# Altium schematic sheet Connector_Sheet2.SchDoc
size 420 x 297 mm; SheetNumber: 8; SheetTotal: 8
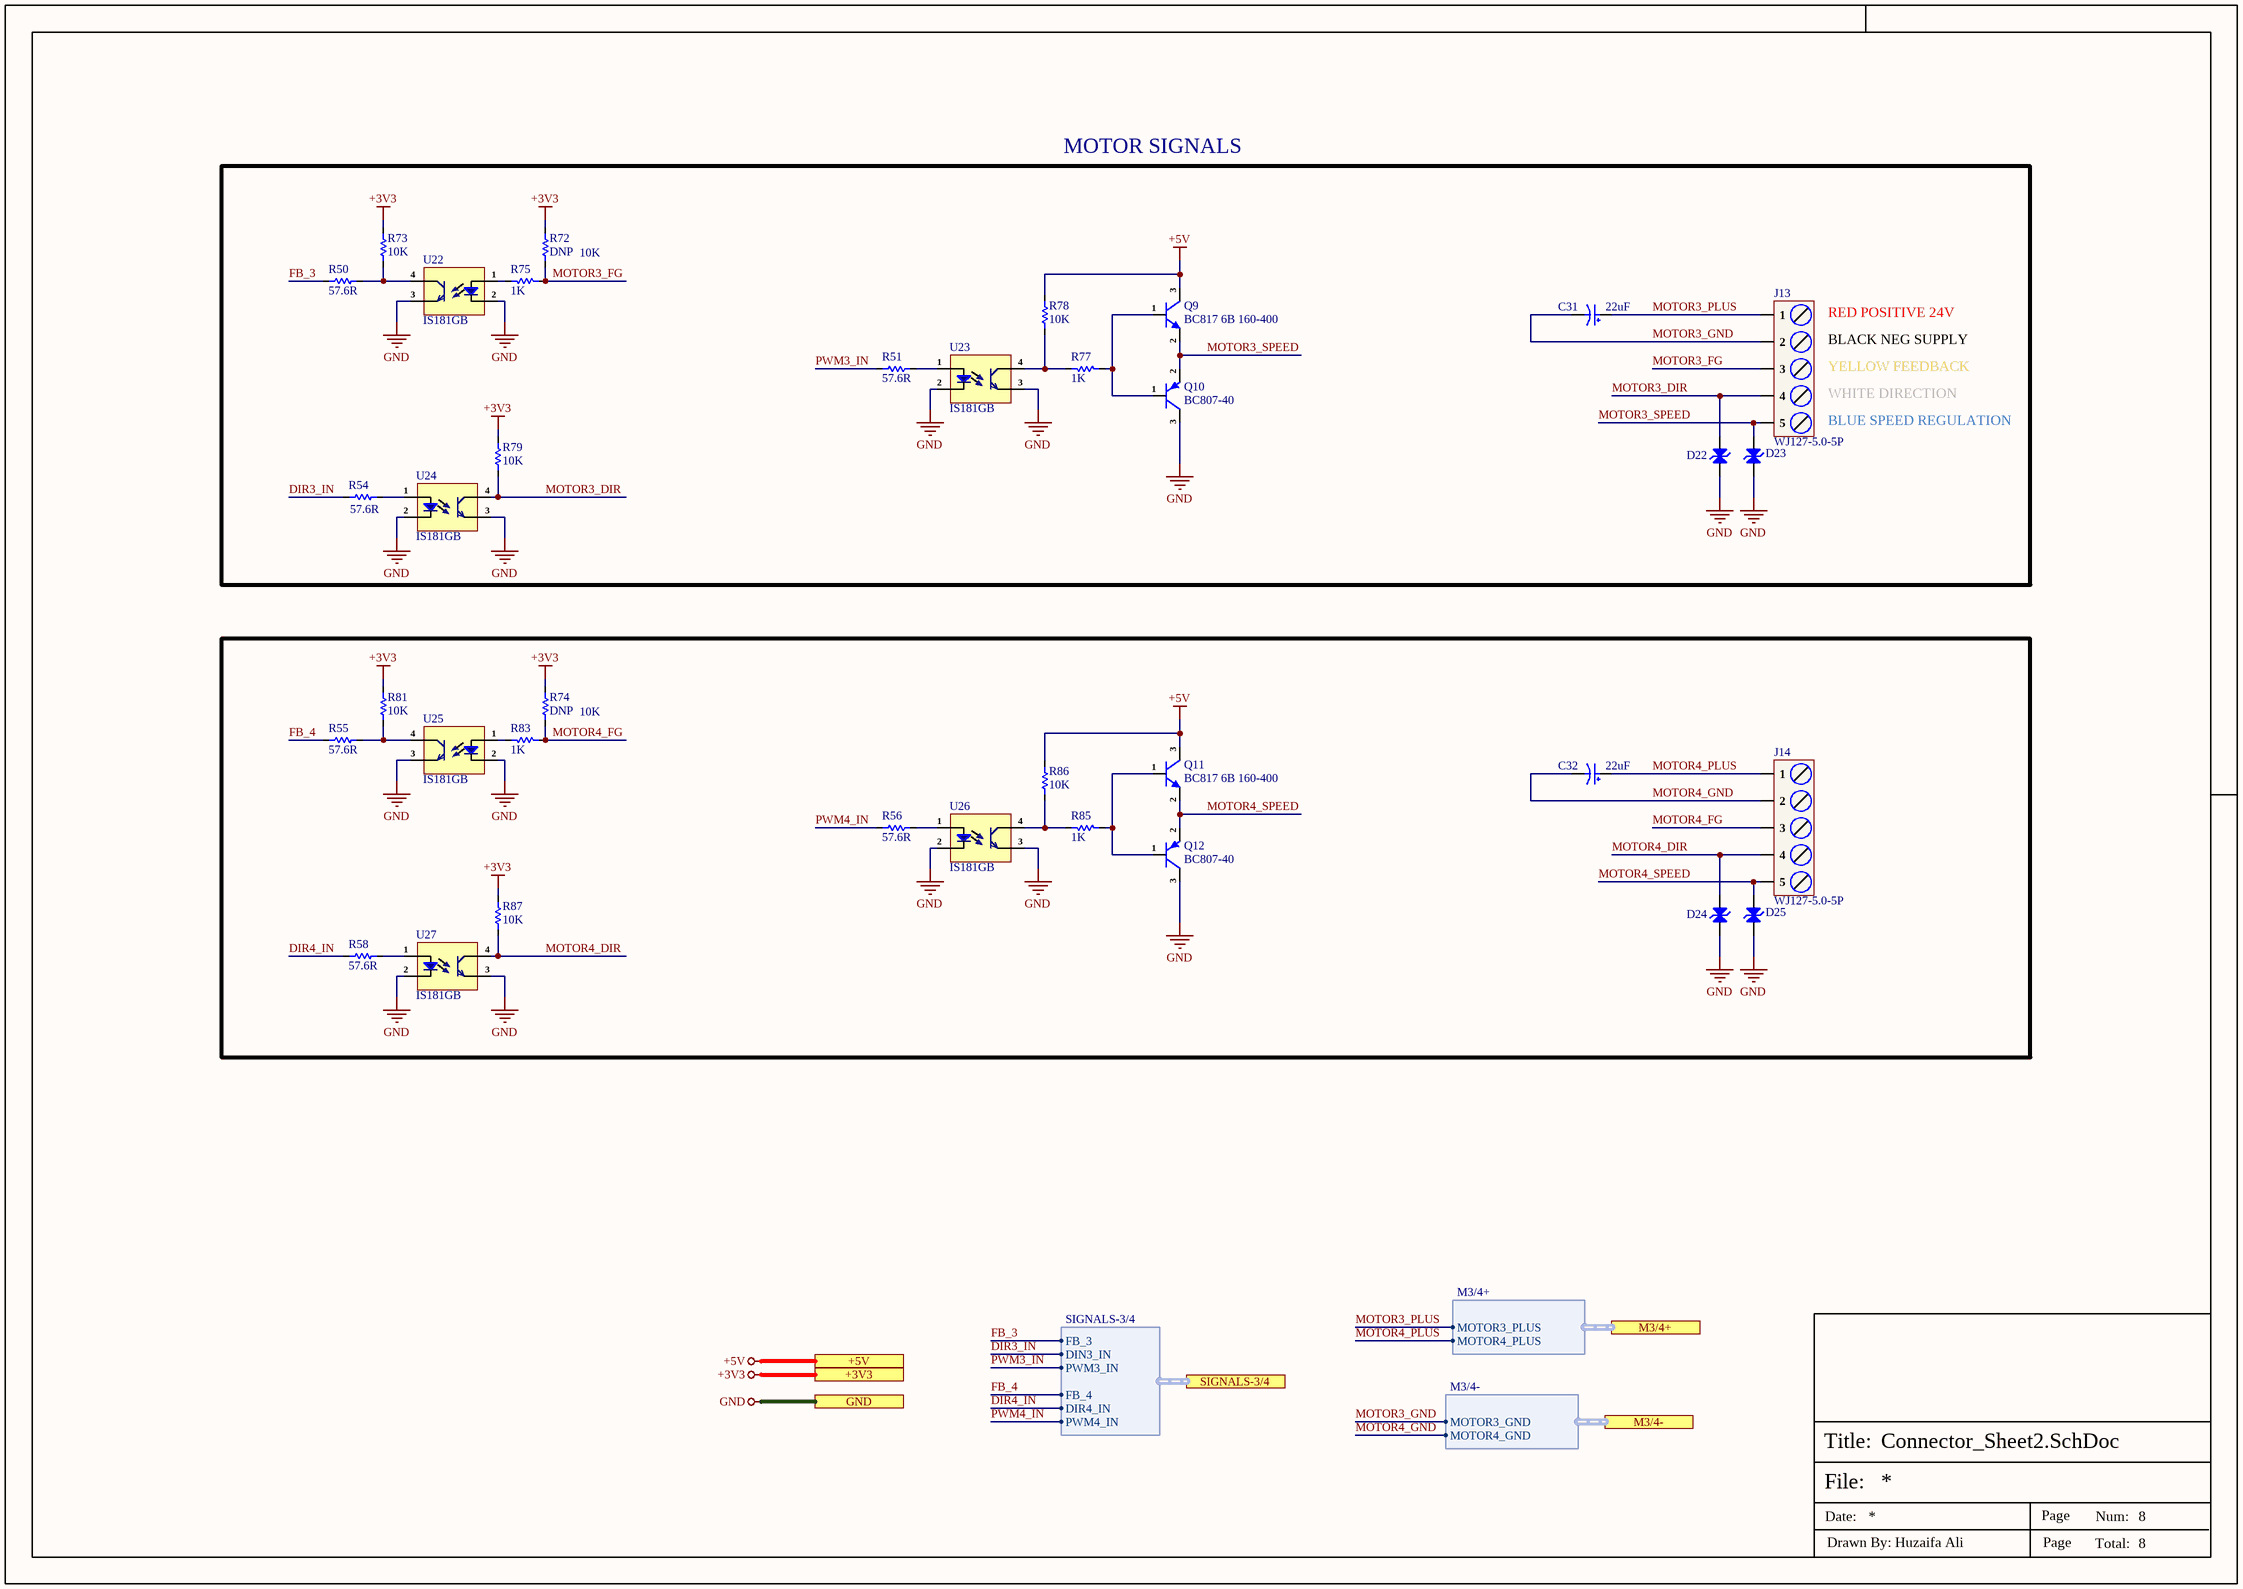
[diagram p0: Connector_Sheet2.SchDoc]

## Parts
C31  22uF  [VKMD1652D220MV]
C32  22uF  [VKMD1652D220MV]
D22  ESD5B5.0ST1G  [SOD-523]  (value not drawn)
D23  ESD5B5.0ST1G  [SOD-523]  (value not drawn)
D24  ESD5B5.0ST1G  [SOD-523]  (value not drawn)
D25  ESD5B5.0ST1G  [SOD-523]  (value not drawn)
J13  WJ127-5.0-5P  [WJ127-5.0-5P]
J14  WJ127-5.0-5P  [WJ127-5.0-5P]
Q9  BC817 6B 160-400  [SOT-23]
Q10  BC807-40  [SOT-23]
Q11  BC817 6B 160-400  [SOT-23]
Q12  BC807-40  [SOT-23]
R50  57.6R  [Res-0402]
R51  57.6R  [Res-0402]
R54  57.6R  [Res-0402]
R55  57.6R  [Res-0402]
R56  57.6R  [Res-0402]
R58  57.6R  [Res-0402]
R72  DNP  [Res-0402]
R73  10K  [Res-0402]
R74  DNP  [Res-0402]
R75  1K  [Res-0402]
R77  1K  [Res-0402]
R78  10K  [Res-0402]
R79  10K  [Res-0402]
R81  10K  [Res-0402]
R83  1K  [Res-0402]
R85  1K  [Res-0402]
R86  10K  [Res-0402]
R87  10K  [Res-0402]
U22  IS181GB  [SOP-4_2.54]
U23  IS181GB  [SOP-4_2.54]
U24  IS181GB  [SOP-4_2.54]
U25  IS181GB  [SOP-4_2.54]
U26  IS181GB  [SOP-4_2.54]
U27  IS181GB  [SOP-4_2.54]

## Blocks framed on the sheet
10K: C32 D24 D25 J14 Q11 Q12 R55 R56 R58 R74 R81 R83 R85-R87 U25-U27

## Ports
+3V3 (see Top_Sheet[3C], CAN_Sheet[5D], Connector_Sheet1[5D], Controller_Sheet[2D], Motor_Driver_Sheet[5D], Power_Sheet[5D], RS485_RS232_Sheet[5D]), +5V (see Top_Sheet[3C], CAN_Sheet[5D], Connector_Sheet1[5D], Power_Sheet[5D]), GND (see Top_Sheet[3C], CAN_Sheet[5D], Connector_Sheet1[5D], Controller_Sheet[2D], Motor_Driver_Sheet[5D], Power_Sheet[5D], RS485_RS232_Sheet[5D]), M3/4+ (harness M3/4+, see Top_Sheet[3C], Motor_Driver_Sheet[3D]), M3/4- (harness M3/4-, see Top_Sheet[3C], Motor_Driver_Sheet[2D]), SIGNALS-3/4 (harness SIGNALS-3/4, see Top_Sheet[4C], Controller_Sheet[1D])

## Harnesses
M3/4+: MOTOR3_PLUS, MOTOR4_PLUS
M3/4-: MOTOR3_GND, MOTOR4_GND
SIGNALS-3/4: FB_3, DIN3_IN, PWM3_IN, FB_4, DIR4_IN, PWM4_IN

## Nets
+3V3: R72.2 R73.2 R74.2 R79.2 R81.2 R87.2 ; port +3V3
+5V: Q9.3(C) Q11.3(C) R78.1 R86.1 ; port +5V
GND: D22.1(A) D23.1(A) D24.1(A) D25.1(A) Q10.3(C) Q12.3(C) U22.2(Ca) U22.3(E) U23.2(Ca) U23.3(E) U24.2(Ca) U24.3(E) U25.2(Ca) U25.3(E) U26.2(Ca) U26.3(E) U27.2(Ca) U27.3(E) ; port GND
DIR3_IN: R54.1 ; port SIGNALS-3/4.DIN3_IN
DIR4_IN: R58.1 ; port SIGNALS-3/4.DIR4_IN
FB_3: R50.1 ; port SIGNALS-3/4.FB_3
FB_4: R55.1 ; port SIGNALS-3/4.FB_4
MOTOR3_DIR: D22.2(A) J13.4 R79.1 U24.4(C)
MOTOR3_FG: J13.3 R72.1 R75.1
MOTOR3_GND: C31.2 J13.2 ; port M3/4-.MOTOR3_GND
MOTOR3_PLUS: C31.1 J13.1 ; port M3/4+.MOTOR3_PLUS
MOTOR3_SPEED: D23.2(A) J13.5 Q9.2(E) Q10.2(E)
MOTOR4_DIR: D24.2(A) J14.4 R87.1 U27.4(C)
MOTOR4_FG: J14.3 R74.1 R83.1
MOTOR4_GND: C32.2 J14.2 ; port M3/4-.MOTOR4_GND
MOTOR4_PLUS: C32.1 J14.1 ; port M3/4+.MOTOR4_PLUS
MOTOR4_SPEED: D25.2(A) J14.5 Q11.2(E) Q12.2(E)
PWM3_IN: R51.1 ; port SIGNALS-3/4.PWM3_IN
PWM4_IN: R56.1 ; port SIGNALS-3/4.PWM4_IN
NetQ9_1: Q9.1(B) Q10.1(B) R77.1
NetQ11_1: Q11.1(B) Q12.1(B) R85.1
NetR50_2: R50.2 R73.1 U22.4(C)
NetR51_2: R51.2 U23.1(An)
NetR54_2: R54.2 U24.1(An)
NetR55_2: R55.2 R81.1 U25.4(C)
NetR56_2: R56.2 U26.1(An)
NetR58_2: R58.2 U27.1(An)
NetR75_2: R75.2 U22.1(An)
NetR77_2: R77.2 R78.2 U23.4(C)
NetR83_2: R83.2 U25.1(An)
NetR85_2: R85.2 R86.2 U26.4(C)

## Notes on the sheet
- MOTOR SIGNALS
- 10K
- RED POSITIVE 24V
- BLACK NEG SUPPLY
- YELLOW FEEDBACK
- WHITE DIRECTION
- BLUE SPEED REGULATION
- File:
- Title:
- Date:
- Page
- Num:
- Total:
- Drawn By: Huzaifa Ali

## Library data of the parts
C31 C32 = VKMD1652D220MV: 22uF 200V 320mA@100kHz ±20% SMD,D8xL16.5mm Aluminum Electrolytic Capacitors - SMD ROHS; Manufacturer: Ymin; Manufacturer Part Number: VKMD1652D220MV; Package: SMD,D8xL16.5mm; LCSC Part Number: C487500; Item Type: Electrolytic Capacitor; ComponentLink1Description: LCSC; ComponentLink1URL: https://www.lcsc.com/product-detail/Aluminum-Electrolytic-Capacitors-SMD_Ymin-VKMD1652D220MV_C487500.html
D22-D25 = ESD5B5.0ST1G: TVS DIODE 5VWM SOD523; Manufacturer: ON Semiconductor; Item Type: ESD Protection Device; Supplier: Future Electronics; Supplier Part Number: 1159725; Manufacturer Part Number: ESD5B5.0ST1G; RoHS: Yes; Category: ESD and Circuit Protection ICs; Stock: 486000; Pricing: 3000=0.0396, 9000=0.0381, 15000=0.0375, 60000=0.0357, 90000=0.0346 (USD); ComponentLink1URL: https://datasheet.ciiva.com/339/esd5b5-0st1g-339772.pdf?src-supplier=Avnet; ComponentLink1Description: https://datasheet.ciiva.com/339/esd5b5-0st1g-339772.pdf?src-supplier=Avnet; ComponentLink2URL: https://datasheet.ciiva.com/339/esd5b5-0st1g-339772.pdf?src-supplier=Digi-Key; ComponentLink2Description: https://datasheet.ciiva.com/339/esd5b5-0st1g-339772.pdf?src-supplier=Digi-Key; ComponentLink3URL: https://datasheet.ciiva.com/22637/716649-22637178.pdf?src-supplier=Element14; ComponentLink3Description: https://datasheet.ciiva.com/22637/716649-22637178.pdf?src-supplier=Element14; ComponentLink4URL: https://datasheet.ciiva.com/4510/esd5b5-0st1g-241623-4510548.pdf?src-supplier=Mouser; ComponentLink4Description: https://datasheet.ciiva.com/4510/esd5b5-0st1g-241623-4510548.pdf?src-supplier=Mouser; ComponentLink5URL: https://datasheet.ciiva.com/339/esd5b5-0st1-d-339773.pdf?src-supplier=Digi-Key; ComponentLink5Description: https://datasheet.ciiva.com/339/esd5b5-0st1-d-339773.pdf?src-supplier=Digi-Key; ComponentLink6URL: https://datasheet.ciiva.com/339/esd5b5-0st1-d-339774.pdf?src-supplier=Digi-Key; ComponentLink6Description: https://datasheet.ciiva.com/339/esd5b5-0st1-d-339774.pdf?src-supplier=Digi-Key; LCSC Part Number: C93623
J13 J14 = WJ127-5.0-5P: 1x5P -40℃~+105℃ 15A 250V Green 14~26 Straight pin 5mm 1.5 1 5 Plugin,P=5mm Screw terminal ROHS; Manufacturer: Ningbo Kangnex Elec; ComponentLink1Description: LCSC; ComponentLink1URL: https://www.lcsc.com/product-detail/Screw-terminal_Ningbo-Kangnex-Elec-WJ127-5-0-5P_C192780.html; Manufacturer Part Number: WJ127-5.0-5P; Package: Plugin,P=5mm; LCSC Part Number: C192780; Item Type: Screw terminal
Q9 Q11 = BC817 6B 160-400: 45V 300mW 100@100mA,1V 500mA NPN SOT-23 Bipolar Transistors - BJT ROHS; Manufacturer: DOWO; Manufacturer Part Number: BC817 6B 160-400; Package: SOT-23; LCSC Part Number: C371086; Item Type: Transistor; ComponentLink1Description: LCSC; ComponentLink1URL: https://www.lcsc.com/product-detail/Bipolar-Transistors-BJT_DOWO-BC817-6B-160-400_C371086.html
Q10 Q12 = BC807-40: 45V 310mW 250@100mA,1V 800mA SOT-23 Bipolar (BJT) ROHS; Manufacturer: KEXIN; Item Type: (BJT); Manufacturer Part Number: BC807-40; Package: SOT-23; LCSC Part Number: C489159; ComponentLink1Description: LCSC; ComponentLink1URL: https://www.lcsc.com/product-detail/Bipolar-BJT_KEXIN-BC807-40_C489159.html
R50 R51 R54-R56 R58 = ERJ-2RKF57R6X: RES SMD 57.6 OHM 1% 1/10W 0402; Manufacturer: Panasonic; Item Type: Resistors; Supplier: Mouser; Supplier Part Number: 667-ERJ-2RKF57R6X; Manufacturer Part Number: ERJ-2RKF57R6X; RoHS: Yes; Stock: 32931; Pricing: 1=0.1, 10=0.015, 50=0.015, 100=0.009, 1000=0.006, 10000=0.003 (USD); ComponentLink1URL: https://datasheet.ciiva.com/9188/aoa0000ce2-9188571.pdf?src-supplier=Avnet; ComponentLink1Description: https://datasheet.ciiva.com/9188/aoa0000ce2-9188571.pdf?src-supplier=Avnet; ComponentLink2URL: https://datasheet.ciiva.com/9188/aoa0000ce2-9188574.pdf?src-supplier=Avnet; ComponentLink2Description: https://datasheet.ciiva.com/9188/aoa0000ce2-9188574.pdf?src-supplier=Avnet; ComponentLink3URL: https://datasheet.ciiva.com/24026/aoa0000ce2-24026248.pdf?src-supplier=Mouser; ComponentLink3Description: https://datasheet.ciiva.com/24026/aoa0000ce2-24026248.pdf?src-supplier=Mouser; ComponentLink4URL: https://datasheet.ciiva.com/43467/1678782-43467198.pdf?src-supplier=Farnell; ComponentLink4Description: https://datasheet.ciiva.com/43467/1678782-43467198.pdf?src-supplier=Farnell; ComponentLink5URL: https://datasheet.ciiva.com/46372/1678782-46372935.pdf?src-supplier=Element14; ComponentLink5Description: https://datasheet.ciiva.com/46372/1678782-46372935.pdf?src-supplier=Element14; ComponentLink6URL: https://datasheet.ciiva.com/46372/1678782-46372936.pdf?src-supplier=Element14; ComponentLink6Description: https://datasheet.ciiva.com/46372/1678782-46372936.pdf?src-supplier=Element14; ComponentLink7URL: https://datasheet.ciiva.com/22668/1678782-22668391.pdf?src-supplier=Element14; ComponentLink7Description: https://datasheet.ciiva.com/22668/1678782-22668391.pdf?src-supplier=Element14; ComponentLink8URL: https://datasheet.ciiva.com/22743/1678782-22743894.pdf?src-supplier=Element14; ComponentLink8Description: https://datasheet.ciiva.com/22743/1678782-22743894.pdf?src-supplier=Element14; ComponentLink9URL: https://datasheet.ciiva.com/30107/aoa0000ce2-30107676.pdf?src-supplier=Onlinecomponents.com; ComponentLink9Description: https://datasheet.ciiva.com/30107/aoa0000ce2-30107676.pdf?src-supplier=Onlinecomponents.com; LCSC Part Number: C3025671
R72-R74 R78 R79 R81 R86 R87 = RC0402FR-0710KL: RES 10K OHM 1% 1/16W 0402; Manufacturer: Yageo; Resistance: 10kR; Voltage Rating (DC): 50V; Temperature Coefficient: 100ppm/°C; Power Rating: 62.5mW; Max Power Dissipation: 63mW; Item Type: Resistor; Supplier 1: Mouser; Manufacturer Part Number: RC0402FR-0710KL; RoHS: Yes; Category: Chip SMD Resistors; Stock 1: 18648329; Pricing 1: 1=0.10000, 10=0.01400, 50=0.01400, 100=0.00500, 1000=0.00300, 10000=0.00200 (USD); Case/Package: 0402; Number of Pins: 2; Case Code (Imperial): 0402; Case Code (Metric): 1005; Min Operating Temperature: -55°C; Max Operating Temperature: 155°C; Resistor Type: Thick Film; Tolerance: 1%; Packaging: Tape and Reel; Voltage Rating: 50V; Termination: SMD/SMT; Working Voltage: 50V; Number of Terminations: 2; Features: Moisture Resistant; Series: RC; Resistance Tolerance: 1%; Construction: Rectangular; Length: 1mm; Width: 0.5mm; Height: 0.32mm; Depth: 0.5mm; Lead Pitch: 0.2mm; REACH SVHC: No SVHC; Lead Free: Lead Free; RoHS Compliant: Yes; Military Standard: Not; ComponentLink1URL: https://datasheet.ciiva.com/7660/38568-7660787.pdf?src-supplier=Element14; ComponentLink1Description: https://datasheet.ciiva.com/7660/38568-7660787.pdf?src-supplier=Element14; ComponentLink2URL: https://datasheet.ciiva.com/7849/1686128-7849814.pdf?src-supplier=Element14; ComponentLink2Description: https://datasheet.ciiva.com/7849/1686128-7849814.pdf?src-supplier=Element14; ComponentLink3URL: https://datasheet.ciiva.com/7983/1018594-7983486.pdf?src-supplier=Element14; ComponentLink3Description: https://datasheet.ciiva.com/7983/1018594-7983486.pdf?src-supplier=Element14; ComponentLink4URL: https://datasheet.ciiva.com/22747/1018594-22747512.pdf?src-supplier=Element14; ComponentLink4Description: https://datasheet.ciiva.com/22747/1018594-22747512.pdf?src-supplier=Element14; ComponentLink5URL: https://datasheet.ciiva.com/12667/pyu-rc0402-51-rohs-l-6-r-12667067.pdf?src-supplier=Mouser; ComponentLink5Description: https://datasheet.ciiva.com/12667/pyu-rc0402-51-rohs-l-6-r-12667067.pdf?src-supplier=Mouser; ComponentLink6URL: https://datasheet.ciiva.com/7849/1784430-7849813.pdf?src-supplier=Element14; ComponentLink6Description: https://datasheet.ciiva.com/7849/1784430-7849813.pdf?src-supplier=Element14; ComponentLink7URL: https://datasheet.ciiva.com/7849/1784430-7849815.pdf?src-supplier=Element14; ComponentLink7Description: https://datasheet.ciiva.com/7849/1784430-7849815.pdf?src-supplier=Element14; Supplier Part Number 1: 603-RC0402FR-0710KL; LCSC Part Number: C60490
R75 R77 R83 R85 = CRCW04021K00FKEDHP: RES SMD 1K OHM 1% 1/5W 0402; Manufacturer: Vishay Dale; Resistance: 1kR; Temperature Coefficient: 100ppm/°C; Power Rating: 125mW; Voltage Rating: 50V; Supplier 1: Digi-Key; Manufacturer Part Number: CRCW04021K00FKEDHP; Stock 1: 315989; Pricing 1: 1=0.15, 10=0.132, 100=0.0506, 1000=0.02226, 2500=0.01923, 5000=0.0172 (USD); Mount: Surface Mount; Case/Package: 0402; Number of Pins: 2; Contact Plating: Tin; Weight: 2.3E-05oz; Case Code (Imperial): 0402; Case Code (Metric): 1005; Size Code: 0402; Min Operating Temperature: -55°C; Max Operating Temperature: 155°C; Tolerance: 1%; Resistor Type: Thick Film; Package Quantity: 10; Packaging: Tape and Reel; Number of Terminations: 2; Termination: SMD/SMT; Max Power Dissipation: 125mW; Voltage Rating (DC): 50V; Features: Automotive AEC-Q200; Series: CRCW-HP; Construction: Rectangular; Technology: THICK FILM; Resistance Tolerance: 1%; Length: 1mm; Width: 0.5mm; Height: 0.3mm; Depth: 0.5mm; Radiation Hardening: No; REACH SVHC: Unknown; Military Standard: Not; Lead Free: Lead Free; RoHS Compliant: Yes; ComponentLink1URL: http://www.farnell.com/datasheets/2339608.pdf?src-supplier=Element14; ComponentLink1Description: http://www.farnell.com/datasheets/2339608.pdf?src-supplier=Element14; ComponentLink2URL: http://www.vishay.com/docs/20043/crcwhpe3.pdf?src-supplier=Digi-Key; ComponentLink2Description: http://www.vishay.com/docs/20043/crcwhpe3.pdf?src-supplier=Digi-Key; ComponentLink3URL: http://www.mouser.com/ds/2/427/crcwhpe3-46056.pdf?src-supplier=Mouser; ComponentLink3Description: http://www.mouser.com/ds/2/427/crcwhpe3-46056.pdf?src-supplier=Mouser; ComponentLink4URL: http://www.vishay.com/docs/20043/crcwhpe3.pdf?src-supplier=Avnet; ComponentLink4Description: http://www.vishay.com/docs/20043/crcwhpe3.pdf?src-supplier=Avnet; ComponentLink5URL: http://www.vishay.com/docs/20043/crcwhpe3.pdf?src-supplier=Future+Electronics; ComponentLink5Description: http://www.vishay.com/docs/20043/crcwhpe3.pdf?src-supplier=Future+Electronics; Supplier Part Number 1: 541-1.00KYCT-ND; LCSC Part Number: C313354
U22-U27 = IS181GB: Optoisolator Transistor Output 3750Vrms 1 Channel; Manufacturer: Isocom; Forward Current: 50mA; Reverse Breakdown Voltage: 6V; Isolation Voltage: 3.75kV; Rise Time: 18000ns; Power Dissipation: 170mW; Number of Elements: 1; Collector Emitter Saturation Voltage: 200mV; Forward Voltage: 1.4V; Collector Emitter Voltage (VCEO): 80V; Current Transfer Ratio: 600%; Item Type: Optocoupler; Supplier 1: Arrow Electronics; Manufacturer Part Number: IS181GB; RoHS: Yes; Category: Optocouplers; Stock 1: 2922; Pricing 1: 1=0.55080, 10=0.34190, 25=0.33860, 50=0.33530, 100=0.19360, 250=0.19160, 500=0.18960, 1000=0.14750 (USD); Mount: Surface Mount; Case/Package: SMD/SMT; Number of Pins: 4; Min Operating Temperature: -55°C; Max Operating Temperature: 100°C; Fall Time: 18000ns; Radiation Hardening: No; Lead Free: Lead Free; RoHS Compliant: Yes; ComponentLink1URL: https://datasheet.ciiva.com/26895/getdatasheetpartid-624485-26895717.pdf?src-supplier=Verical; ComponentLink1Description: https://datasheet.ciiva.com/26895/getdatasheetpartid-624485-26895717.pdf?src-supplier=Verical; ComponentLink2URL: https://datasheet.ciiva.com/29301/183289-da-01-en-optokoppler-is181-gb-29301106.pdf?src-supplier=Conrad; ComponentLink2Description: https://datasheet.ciiva.com/29301/183289-da-01-en-optokoppler-is181-gb-29301106.pdf?src-supplier=Conrad; Supplier Part Number 1: IS181GB; LCSC Part Number: C84196